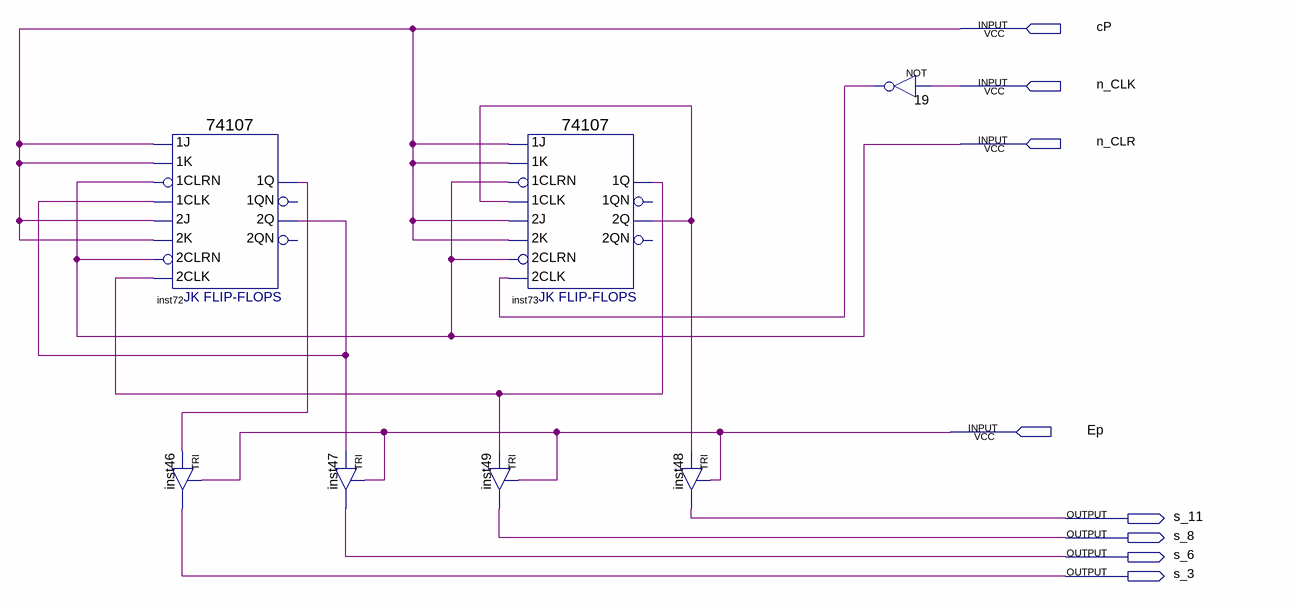
[diagram p0: schematic sheet]
// Quartus schematic Contador de Programas.bdf as structural Verilog: 7 symbols, 8 pins
module \Contador_de_Programas  (
  input  cP,
  input  n_CLK,
  input  n_CLR,
  input  Ep,
  output s_11,
  output s_8,
  output s_6,
  output s_3
);

  wire inst72_1q, inst72_2q, inst73_1q, inst73_2q, n19_out;

  \74107  inst72 (
    .\1CLRN (n_CLR), .\1K (cP), .\1J (cP), .\2K (cP), .\2J (cP), .\1CLK (inst72_2q), .\2CLK (inst73_1q),
    .\2CLRN (n_CLR), .\1Q (inst72_1q), .\2Q (inst72_2q));  // open: 1QN, 2QN
  TRI inst46 (.IN(inst72_1q), .OE(Ep), .OUT(s_3));
  TRI inst47 (.IN(inst72_2q), .OE(Ep), .OUT(s_6));
  \74107  inst73 (
    .\1CLRN (n_CLR), .\1K (cP), .\1J (cP), .\2K (cP), .\2J (cP), .\1CLK (inst73_2q), .\2CLK (n19_out),
    .\2CLRN (n_CLR), .\1Q (inst73_1q), .\2Q (inst73_2q));  // open: 1QN, 2QN
  TRI inst49 (.IN(inst73_1q), .OE(Ep), .OUT(s_8));
  TRI inst48 (.IN(inst73_2q), .OE(Ep), .OUT(s_11));
  not u_19 (n19_out, n_CLK);
endmodule
